# EAGLE board Mustang_Duino (EAGLE 7.7.0)
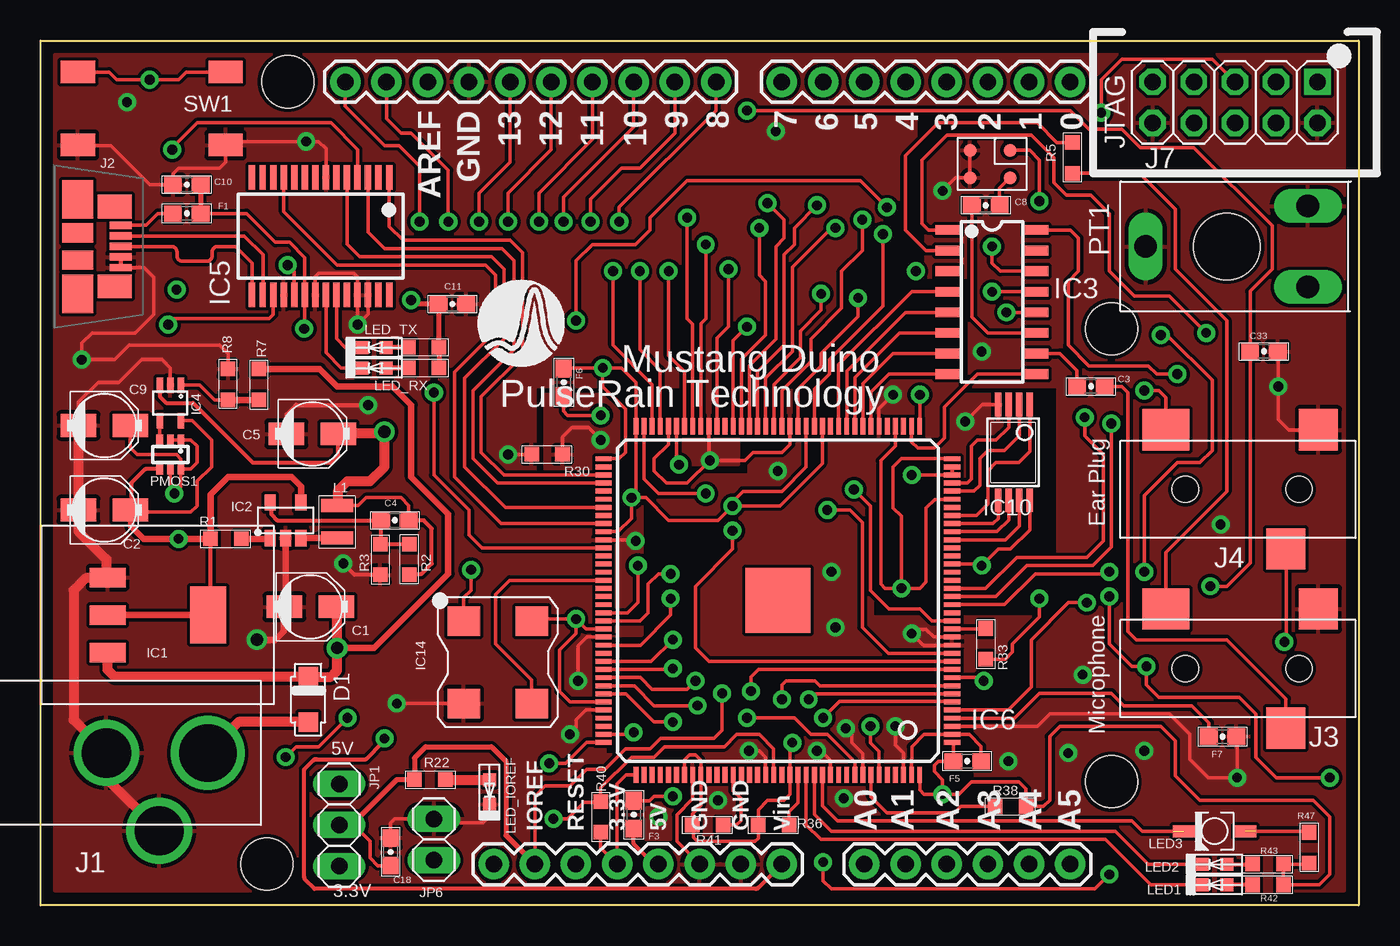
[diagram p14: board, top side]
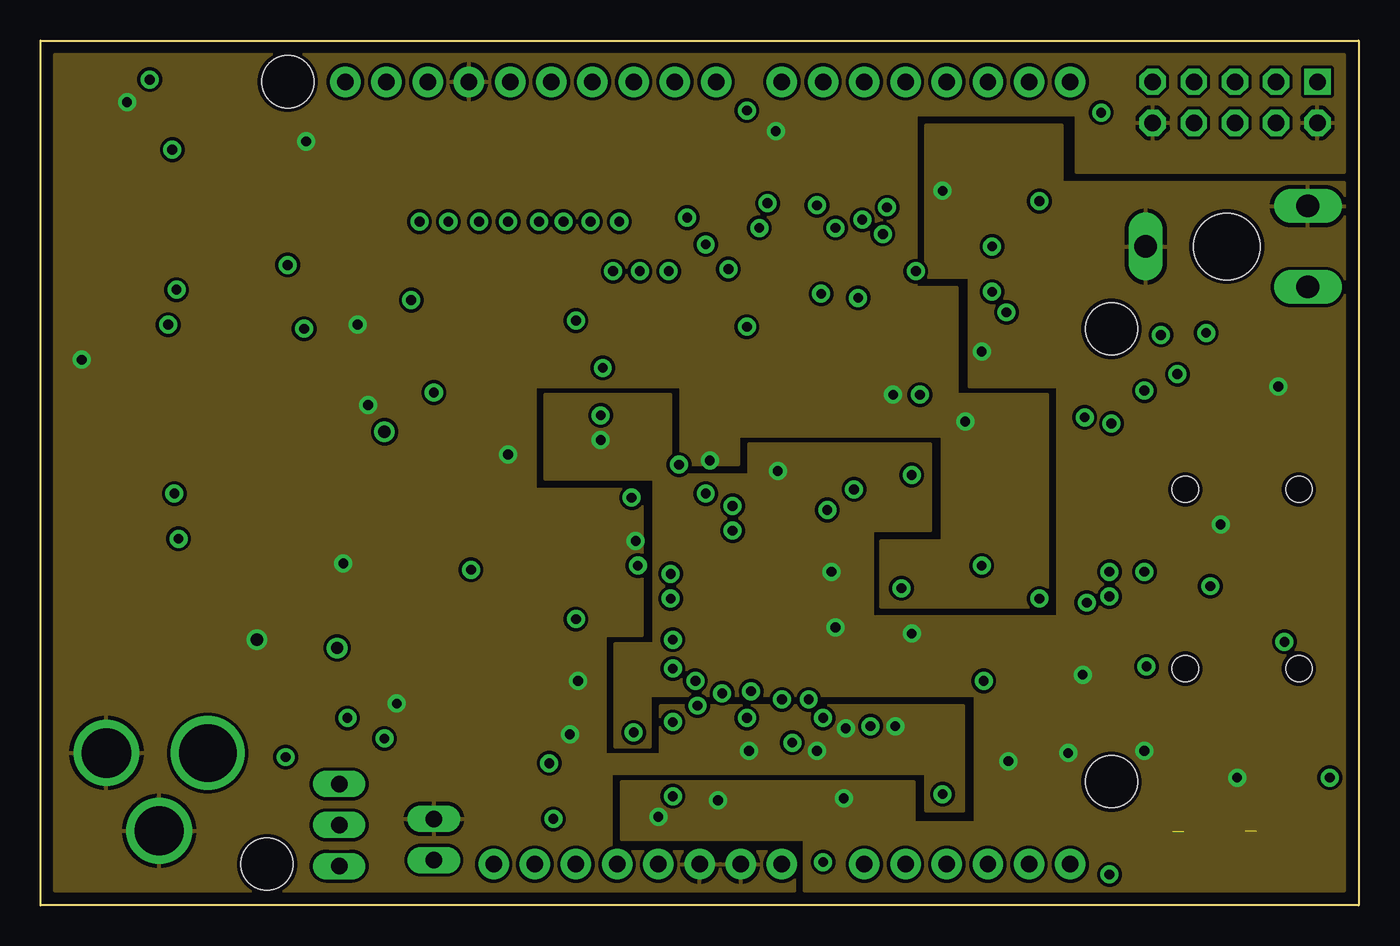
[diagram p15: board, inner layer Ground]
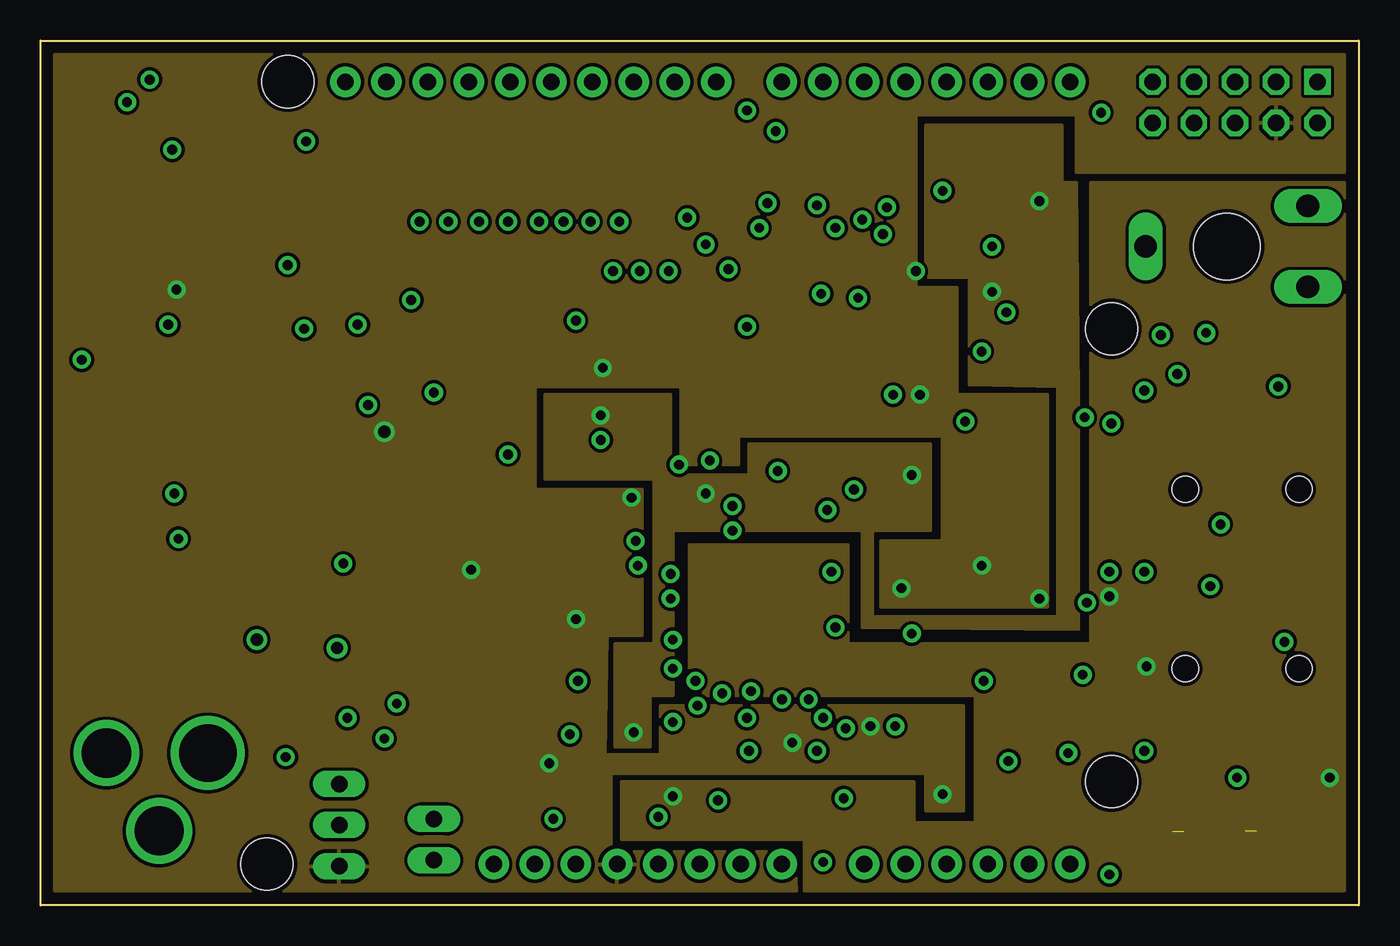
[diagram p16: board, inner layer Power]
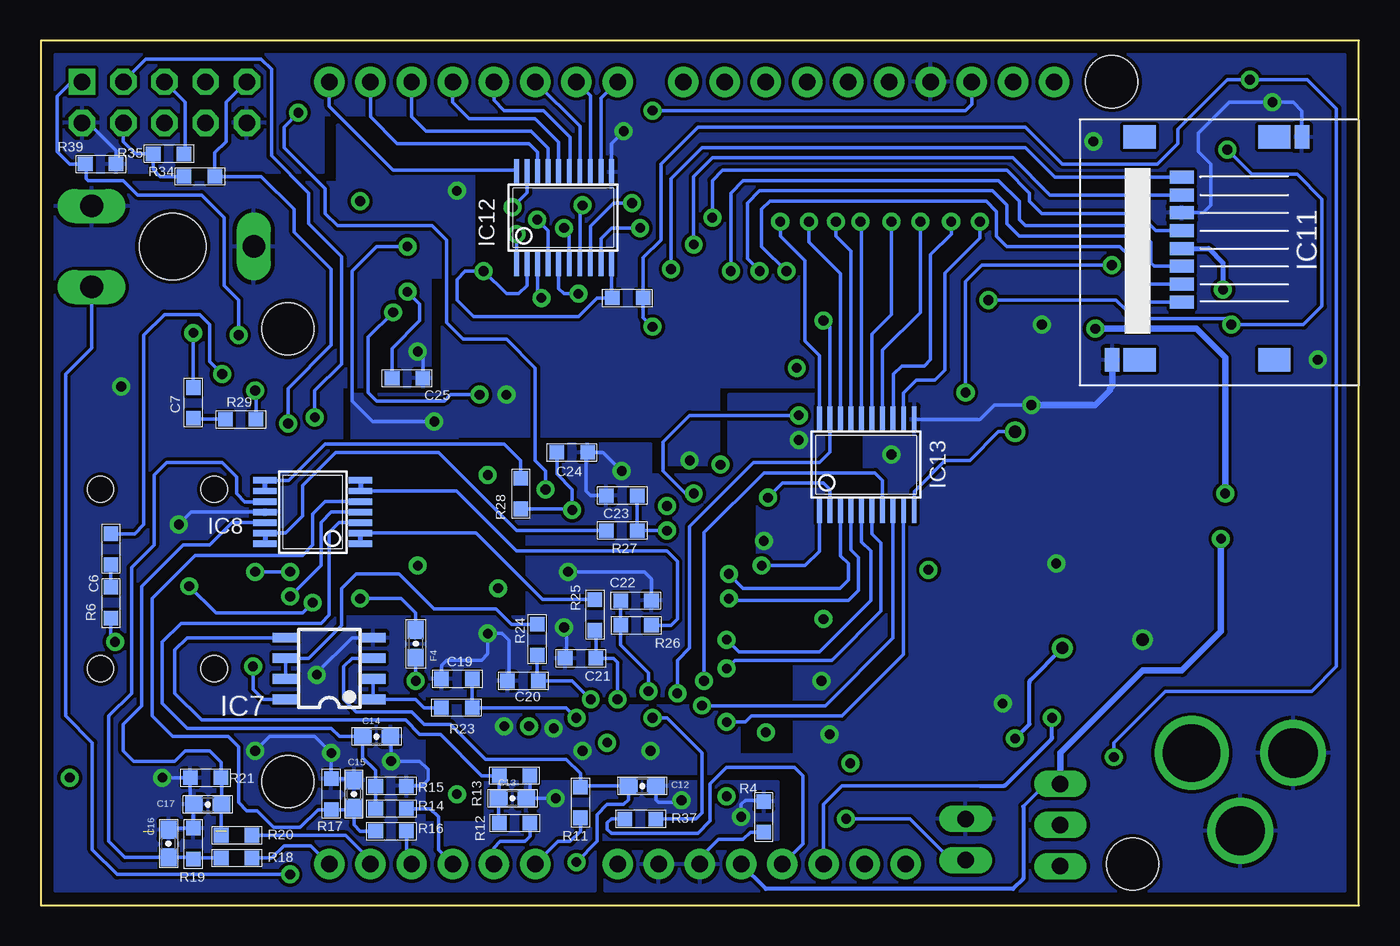
[diagram p17: board, bottom side, seen from below]

Size 81.28 x 53.34 mm. Coordinates in mm from the lower left corner, seen from the top.
Copper layers (1+2*15+16): Top 0.035mm / dielectric 0.14328125mm / Ground 0.018mm / dielectric 0.39mm / Power 0.018mm / dielectric 0.14328125mm / Bottom 0.035mm
Design rules "PulseRain_default *": minimum track width 6mil, minimum drill 20mil, track to track 8mil, track to pad 8mil, pad to pad 7.5mil, via to via 7.5mil, smd to smd 7.5mil, copper to edge 10mil, drill to drill 8mil, minimum pad ring 12mil, minimum via ring 10mil, stop-mask expansion 4mil, vias tented up to drill 25mil, thermal gap 10mil
Net classes: 0 default: width 0.203 mm, clearance 0.191 mm; 1 supply: width 0.203 mm, clearance 0.191 mm; 2 diff: width 0.203 mm, clearance 0.191 mm

## Footprints (pad centres in the part's own frame; a part is rotated, then mirrored left to right if it is on the bottom)
PANASONIC_B = smd 2.2 x 1.4: + 1.6,0; - -1.6,0
0603-CAP = smd 1.1 x 1: 1 -0.85,0; 2 0.85,0
VISHAY-R-0603 = smd 0.9 x 0.9: P$1 0.95,0; P$2 -0.95,0
SOD123W = smd 1.2 x 1.2: 1 1.4,0; 2 -1.4,0
0603-BEAD = smd 1.1 x 1: 1 -0.85,0; 2 0.85,0
SOT223 = smd 1.194 x 2.21: 1 -2.311,-3.099; 2 0,-3.099; 3 2.311,-3.099 | smd 3.505 x 2.21: VOUT 0,3.099
TSOT25 = smd 0.7 x 1: 1 -0.95,-1.1; 2 0,-1.1; 3 0.95,-1.1; 4 0.95,1.1; 5 -0.95,1.1
SOIC-16 = smd 0.6 x 1.55: 1 -4.445,-2.7; 2 -3.175,-2.7; 3 -1.905,-2.7; 4 -0.635,-2.7; 5 0.635,-2.7; 6 1.905,-2.7; 7 3.175,-2.7; 8 4.445,-2.7; 9 4.445,2.7; 10 3.175,2.7; 11 1.905,2.7; 12 0.635,2.7; 13 -0.635,2.7; 14 -1.905,2.7; 15 -3.175,2.7; 16 -4.445,2.7
SC-70-5 = smd 0.4 x 0.95: 1 -0.65,-1.1; 2 0,-1.1; 3 0.65,-1.1; 4 0.65,1.1; 5 -0.65,1.1
SSOP28 = smd 0.4 x 1.5: 1 -4.225,-3.625; 2 -3.575,-3.625; 3 -2.925,-3.625; 4 -2.275,-3.625; 5 -1.625,-3.625; 6 -0.975,-3.625; 7 -0.325,-3.625; 8 0.325,-3.625; 9 0.975,-3.625; 10 1.625,-3.625; 11 2.275,-3.625; 12 2.925,-3.625; 13 3.575,-3.625; 14 4.225,-3.625; 15 4.225,3.625; 16 3.575,3.625; 17 2.925,3.625; 18 2.275,3.625; 19 1.625,3.625; 20 0.975,3.625; 21 0.325,3.625; 22 -0.325,3.625; 23 -0.975,3.625; 24 -1.625,3.625; 25 -2.275,3.625; 26 -2.925,3.625; 27 -3.575,3.625; 28 -4.225,3.625
EQFP144 = smd 1 x 0.3: 1 -10.75,8.75; 2 -10.75,8.25; 3 -10.75,7.75; 4 -10.75,7.25; 5 -10.75,6.75; 6 -10.75,6.25; 7 -10.75,5.75; 8 -10.75,5.25; 9 -10.75,4.75; 10 -10.75,4.25; 11 -10.75,3.75; 12 -10.75,3.25; 13 -10.75,2.75; 14 -10.75,2.25; 15 -10.75,1.75; 16 -10.75,1.25; 17 -10.75,0.75; 18 -10.75,0.25; 19 -10.75,-0.25; 20 -10.75,-0.75; 21 -10.75,-1.25; 22 -10.75,-1.75; 23 -10.75,-2.25; 24 -10.75,-2.75; 25 -10.75,-3.25; 26 -10.75,-3.75; 27 -10.75,-4.25; 28 -10.75,-4.75; 29 -10.75,-5.25; 30 -10.75,-5.75; 31 -10.75,-6.25; 32 -10.75,-6.75; 33 -10.75,-7.25; 34 -10.75,-7.75; 35 -10.75,-8.25; 36 -10.75,-8.75; 73 10.75,-8.75; 74 10.75,-8.25; 75 10.75,-7.75; 76 10.75,-7.25; 77 10.75,-6.75; 78 10.75,-6.25; 79 10.75,-5.75; 80 10.75,-5.25; 81 10.75,-4.75; 82 10.75,-4.25; 83 10.75,-3.75; 84 10.75,-3.25; 85 10.75,-2.75; 86 10.75,-2.25; 87 10.75,-1.75; 88 10.75,-1.25; 89 10.75,-0.75; 90 10.75,-0.25; 91 10.75,0.25; 92 10.75,0.75; 93 10.75,1.25; 94 10.75,1.75; 95 10.75,2.25; 96 10.75,2.75; 97 10.75,3.25; 98 10.75,3.75; 99 10.75,4.25; 100 10.75,4.75; 101 10.75,5.25; 102 10.75,5.75; 103 10.75,6.25; 104 10.75,6.75; 105 10.75,7.25; 106 10.75,7.75; 107 10.75,8.25; 108 10.75,8.75 | smd 0.3 x 1: 37 -8.75,-10.75; 38 -8.25,-10.75; 39 -7.75,-10.75; 40 -7.25,-10.75; 41 -6.75,-10.75; 42 -6.25,-10.75; 43 -5.75,-10.75; 44 -5.25,-10.75; 45 -4.75,-10.75; 46 -4.25,-10.75; 47 -3.75,-10.75; 48 -3.25,-10.75; 49 -2.75,-10.75; 50 -2.25,-10.75; 51 -1.75,-10.75; 52 -1.25,-10.75; 53 -0.75,-10.75; 54 -0.25,-10.75; 55 0.25,-10.75; 56 0.75,-10.75; 57 1.25,-10.75; 58 1.75,-10.75; 59 2.25,-10.75; 60 2.75,-10.75; 61 3.25,-10.75; 62 3.75,-10.75; 63 4.25,-10.75; 64 4.75,-10.75; 65 5.25,-10.75; 66 5.75,-10.75; 67 6.25,-10.75; 68 6.75,-10.75; 69 7.25,-10.75; 70 7.75,-10.75; 71 8.25,-10.75; 72 8.75,-10.75; 109 8.75,10.75; 110 8.25,10.75; 111 7.75,10.75; 112 7.25,10.75; 113 6.75,10.75; 114 6.25,10.75; 115 5.75,10.75; 116 5.25,10.75; 117 4.75,10.75; 118 4.25,10.75; 119 3.75,10.75; 120 3.25,10.75; 121 2.75,10.75; 122 2.25,10.75; 123 1.75,10.75; 124 1.25,10.75; 125 0.75,10.75; 126 0.25,10.75; 127 -0.25,10.75; 128 -0.75,10.75; 129 -1.25,10.75; 130 -1.75,10.75; 131 -2.25,10.75; 132 -2.75,10.75; 133 -3.25,10.75; 134 -3.75,10.75; 135 -4.25,10.75; 136 -4.75,10.75; 137 -5.25,10.75; 138 -5.75,10.75; 139 -6.25,10.75; 140 -6.75,10.75; 141 -7.25,10.75; 142 -7.75,10.75; 143 -8.25,10.75; 144 -8.75,10.75 | smd 4 x 4: E 0,0
SOIC-SN-8 = smd 0.6 x 1.55: 1 -1.905,-2.7; 2 -0.635,-2.7; 3 0.635,-2.7; 4 1.905,-2.7; 5 1.905,2.7; 6 0.635,2.7; 7 -0.635,2.7; 8 -1.905,2.7
TSSOP-ST-14 = smd 0.4 x 1.45: 1 -1.95,-2.95; 2 -1.3,-2.95; 3 -0.65,-2.95; 4 0,-2.95; 5 0.65,-2.95; 6 1.3,-2.95; 7 1.95,-2.95; 8 1.95,2.95; 9 1.3,2.95; 10 0.65,2.95; 11 0,2.95; 12 -0.65,2.95; 13 -1.3,2.95; 14 -1.95,2.95
TSSOP-ST-8 = smd 0.4 x 1.45: 1 -1.95,-2.95; 2 -1.3,-2.95; 3 -0.65,-2.95; 4 0,-2.95; 5 0,2.95; 6 -0.65,2.95; 7 -1.3,2.95; 8 -1.95,2.95
ALPS-SCHD3A0100 = smd 0.8 x 1.5: 1 3.3,0; 2 2.2,0; 3 1.1,0; 4 0,0; 5 -1.1,0; 6 -2.2,0; 7 -3.3,0; 8 -4.4,0 | smd 1.45 x 2: EP1 -6.875,5.7; EP2 -6.875,-2.6; EP3 6.875,-2.6; EP4 6.875,5.7 | smd 1.45 x 0.9: GND1 -6.875,7.4; GND2 6.875,-4.3
TSSOP8 = smd 0.3 x 1.6: 1 -2.925,-2.8; 2 -2.275,-2.8; 3 -1.625,-2.8; 4 -0.975,-2.8; 5 -0.325,-2.8; 6 0.325,-2.8; 7 0.975,-2.8; 8 1.625,-2.8; 9 2.275,-2.8; 10 2.925,-2.8; 11 2.925,2.8; 12 2.275,2.8; 13 1.625,2.8; 14 0.975,2.8; 15 0.325,2.8; 16 -0.325,2.8; 17 -0.975,2.8; 18 -1.625,2.8; 19 -2.275,2.8; 20 -2.925,2.8
KC7050K = smd 1.8 x 2: 1 -2.54,-2.1; 2 2.54,-2.1; 3 2.54,2.1; 4 -2.54,2.1
RAPC722X = drill 3.048 pad 4.064: 1 4.801,3.251; 2 0,0 | drill 3.556 pad 4.572: 3 0,6.248
SD-47346-001 = smd 1.38 x 0.45: 1 2.66,1.3; 2 2.66,0.65; 3 2.66,0; 4 2.66,-0.65; 5 2.66,-1.3 | smd 1.9 x 2.375: EP1 0,2.913; EP4 0,-2.913 | smd 1.9 x 1.175: EP2 0,0.838; EP3 0,-0.838 | smd 2.1 x 1.475: EP5 2.3,-2.462; EP6 2.3,2.462
PHONE_JACK_NOT_SWITCHED = smd 2.4 x 2.55: 1 0.8,3.675; 5 -1.2,-3.675 | smd 2.9 x 2.55: 4 8.2,-3.675 | hole 1.6: 0,0; 7,0
2X05 = drill 1.016 square: 1 -5.08,-1.27 | drill 1.016 octagon: 2 -5.08,1.27; 3 -2.54,-1.27; 4 -2.54,1.27; 5 0,-1.27; 6 0,1.27; 7 2.54,-1.27; 8 2.54,1.27; 9 5.08,-1.27; 10 5.08,1.27
DUINO_IO_HEADER_10 = drill 1.016 pad 1.88: 8 22.606,0; 9 20.066,0; 10 17.526,0; 11 14.986,0; 12 12.446,0; 13 9.906,0; AREF 4.826,0; GND 7.366,0; SCL -0.254,0; SDA 2.286,0
DUINO_IO_HEADER_8 = drill 1.016 pad 1.88: 0 17.78,0; 1 15.24,0; 2 12.7,0; 3 10.16,0; 4 7.62,0; 5 5.08,0; 6 2.54,0; 7 0,0
DUINO_PWR_HEADER_8 = drill 1.016 pad 1.88: 3.3V 7.62,0; 5V 10.16,0; GND. 15.24,0; GND.. 12.7,0; I/OREF 2.54,0; N/C 0,0; RESET 5.08,0; VIN 17.78,0
DUINO_ANALOG_HEADER_6 = drill 1.016 pad 1.88: A0 0,0; A1 2.54,0; A2 5.08,0; A3 7.62,0; A4 10.16,0; A5 12.7,0
1X03 = drill 1.016 long: 1 -2.54,0; 2 0,0; 3 2.54,0
1X02 = drill 1.016 long: 1 -1.27,0; 2 1.27,0
DFE252012C = smd 0.8 x 2: 1 1,0; 2 -1,0
HARVATEK_0603 = smd 0.8 x 0.8: A -0.75,0; C 0.75,0
VISHAY_VLD_1235G = smd 1.35 x 0.75: A 1.9,0; C -1.9,0
MEMS_MICROPHONE = smd 0.8 x 0.8: 1 -0.85,1.23; 2 -0.85,-1.23; 3 0.85,-1.23; 4 0.85,1.23
SC70-6L = smd 0.41 x 0.65: 1 -0.65,-0.9; 2 0,-0.9; 3 0.65,-0.9; 4 0.65,0.9; 5 -0.65,0.9; 6 0,0.9
PT10LV10 = drill 1.4 long: 1A -2.5,-5; 1E 2.5,-5; 1S 0,5 | hole 4.1: 0,0
TE-2-1437565-8 = smd 1.4 x 2.1: 1 2.25,4.55; 2 2.25,-4.55; 3 -2.25,4.55; 4 -2.25,-4.55
DUINO = hole 3.2: 66.04,7.62; 66.04,35.56; 15.24,50.8; 13.97,2.54

## Placement (x,y rotation side)
C1  22u  [PANASONIC_B]  16.64,18.41 0 top
C2  22u  [PANASONIC_B]  3.94,24.38 0 top
C3  0.1u  [0603-CAP]  64.77,32 0 top
C4  22p  [0603-CAP]  21.84,23.75 180 top
C5  22u  [PANASONIC_B]  16.76,29.08 0 top
C6  1u  [VISHAY-R-0603]  76.96,21.97 90 bottom
C7  1u  [VISHAY-R-0603]  71.88,30.99 90 bottom
C8  0.1u  [0603-CAP]  58.29,43.18 0 top
C9  22u  [PANASONIC_B]  3.94,29.59 0 top
C10  0.1u  [0603-CAP]  9.02,44.45 180 top
C11  0.1u  [0603-CAP]  25.4,37.08 0 top
C12  1p  [0603-CAP]  44.2,7.37 0 bottom
C13  1p  [0603-CAP]  52.2,6.6 0 bottom
C14  1p  [0603-CAP]  60.58,10.41 0 bottom
C15  1p  [0603-CAP]  61.98,6.86 90 bottom
C16  1p  [0603-CAP]  73.41,3.81 90 bottom
C17  1p  [0603-CAP]  70.99,6.22 180 bottom
C18  0.1u  [0603-CAP]  21.59,3.3 90 top
C19  1000p  [VISHAY-R-0603]  55.63,13.97 0 bottom
C20  1000p  [VISHAY-R-0603]  51.56,13.84 0 bottom
C21  1000p  [VISHAY-R-0603]  48.01,15.24 0 bottom
C22  1000p  [VISHAY-R-0603]  44.58,18.8 180 bottom
C23  1000p  [VISHAY-R-0603]  45.47,25.27 0 bottom
C24  1000p  [VISHAY-R-0603]  48.51,27.94 180 bottom
C25  1u  [VISHAY-R-0603]  58.67,32.51 180 bottom
C33  0.1u  [0603-CAP]  75.44,34.16 0 top
D1  PMEG3020ER  [SOD123W]  16.51,12.7 90 top
F1  BLM18PG121SZ1D  [0603-BEAD]  9.02,42.67 0 top
F3  BLM18PG121SZ1D  [0603-BEAD]  36.58,5.59 270 top
F4  BLM18PG121SZ1D  [0603-BEAD]  58.17,16.13 270 bottom
F5  BLM18PG121SZ1D  [0603-BEAD]  57.15,8.89 0 top
F6  BLM18PG121SZ1D  [0603-BEAD]  32.26,32.26 270 top
F7  BLM18PG121SZ1D  [0603-BEAD]  72.9,10.41 180 top
IC1  AZ1117IH-5.0TRG1  [SOT223]  7.24,17.91 270 top
IC2  AP3429A  [TSOT25]  15.11,23.75 0 top
IC3  SI3000  [SOIC-16]  58.67,37.21 270 top
IC4  MCP6241UT-E/LT  [SC-70-5]  8,30.99 180 top
IC5  FT232RL  [SSOP28]  17.27,41.27 180 top
IC6  MAX10M08SAE144  [EQFP144]  45.47,18.8 180 top
IC7  MCP6242T-E/SN  [SOIC-SN-8]  63.5,14.61 90 bottom
IC8  MCP6244T-E/ST  [TSSOP-ST-14]  64.52,24.26 90 bottom
IC10  SRAM  [TSSOP-ST-8]  59.05,27.94 180 top
IC11  MICRO_SD_SOCKET  [ALPS-SCHD3A0100]  10.92,40.51 270 bottom
IC12  TXS0108EPWR  [TSSOP8]  49.02,42.42 0 bottom
IC13  TXS0108EPWR  [TSSOP8]  30.35,27.18 0 bottom
IC14  12MHz  [KC7050K]  28.19,14.99 270 top
J1  RAPC722X  [RAPC722X]  4.06,9.4 270 top
J2  MICRO-USB-B  [SD-47346-001]  2.29,40.64 0 top
J3  PHONE_JACK_NOT_SWITCHED  [PHONE_JACK_NOT_SWITCHED]  77.6,14.61 180 top
J4  PHONE_JACK_NOT_SWITCHED  [PHONE_JACK_NOT_SWITCHED]  77.6,25.65 180 top
J7  ALTERA_JTAG  [2X05]  73.66,49.53 180 top
J8  DUINO_IO_HEADER_10  [DUINO_IO_HEADER_10]  19.05,50.8 0 top
J9  DUINO_HEADER_8  [DUINO_IO_HEADER_8]  45.72,50.8 0 top
J10  DUINO_HEADER_8  [DUINO_PWR_HEADER_8]  27.94,2.54 0 top
J11  DUINO_ANALOG_HEADER_6  [DUINO_ANALOG_HEADER_6]  50.8,2.54 0 top
JP1  IOREF JUMPER  [1X03]  18.41,4.95 270 top
JP6  BOOT IMAGE SELECT  [1X02]  24.26,4.06 90 top
L1  2.2u  [DFE252012C]  18.29,23.67 270 top
LED1  GREEN  [HARVATEK_0603]  72.39,1.27 180 top
LED2  RED  [HARVATEK_0603]  72.39,2.54 180 top
LED3  VLDR1235G  [VISHAY_VLD_1235G]  72.39,4.57 0 top
LED_IOREF  BLUE  [HARVATEK_0603]  27.69,6.99 270 top
LED_RX  GREEN  [HARVATEK_0603]  20.57,33.15 180 top
LED_TX  RED  [HARVATEK_0603]  20.57,34.42 180 top
MIC1  MEMS_MICROPHONE  [MEMS_MICROPHONE]  58.55,45.72 270 top
PMOS1  PMOS_SQ1421EDH  [SC70-6L]  8,27.81 180 top
PT1  200k  [PT10LV10]  73.15,40.64 90 top
R1  10k  [VISHAY-R-0603]  11.43,22.61 180 top
R2  226k, 1%  [VISHAY-R-0603]  22.73,21.34 90 top
R3  49.9k, 1%  [VISHAY-R-0603]  20.95,21.34 270 top
R4  0  [VISHAY-R-0603]  36.7,5.46 270 bottom
R5  2.2k  [VISHAY-R-0603]  63.63,46.1 90 top
R6  30  [VISHAY-R-0603]  76.96,18.67 270 bottom
R7  10k  [VISHAY-R-0603]  13.46,32.13 270 top
R8  10k  [VISHAY-R-0603]  11.56,32.13 90 top
R9  330  [VISHAY-R-0603]  23.62,34.42 180 top
R10  330  [VISHAY-R-0603]  23.62,33.15 180 top
R11  100k  [VISHAY-R-0603]  48.01,6.35 270 bottom
R12  100k  [VISHAY-R-0603]  52.07,5.08 0 bottom
R13  200k  [VISHAY-R-0603]  52.07,8 180 bottom
R14  100k  [VISHAY-R-0603]  59.69,5.97 0 bottom
R15  200k  [VISHAY-R-0603]  59.69,7.37 0 bottom
R16  100k  [VISHAY-R-0603]  59.69,4.57 0 bottom
R17  200k  [VISHAY-R-0603]  63.37,6.86 90 bottom
R18  100k  [VISHAY-R-0603]  69.22,2.92 0 bottom
R19  200k  [VISHAY-R-0603]  71.88,3.81 270 bottom
R20  100k  [VISHAY-R-0603]  69.22,4.32 0 bottom
R21  200k  [VISHAY-R-0603]  71.12,7.87 180 bottom
R22  330  [VISHAY-R-0603]  24,7.75 0 top
R23  100  [VISHAY-R-0603]  55.63,12.19 180 bottom
R24  100  [VISHAY-R-0603]  50.67,16.38 90 bottom
R25  100  [VISHAY-R-0603]  47.12,17.91 90 bottom
R26  100  [VISHAY-R-0603]  44.58,17.27 0 bottom
R27  100  [VISHAY-R-0603]  45.47,23.11 0 bottom
R28  100  [VISHAY-R-0603]  51.69,25.4 270 bottom
R29  30  [VISHAY-R-0603]  68.96,29.97 0 bottom
R30  0  [VISHAY-R-0603]  31.24,27.81 180 top
R32  DNI  [VISHAY-R-0603]  45.09,37.47 180 bottom
R33  10k  [VISHAY-R-0603]  58.29,16.13 270 top
R34  10k  [VISHAY-R-0603]  71.5,44.96 0 bottom
R35  10k  [VISHAY-R-0603]  73.41,46.35 0 bottom
R36  10k  [VISHAY-R-0603]  45.21,4.95 180 top
R37  10k  [VISHAY-R-0603]  44.32,5.33 0 bottom
R38  10k  [VISHAY-R-0603]  59.82,6.1 180 top
R39  1k  [VISHAY-R-0603]  77.6,45.72 0 bottom
R40  10k  [VISHAY-R-0603]  34.54,5.46 270 top
R41  10k  [VISHAY-R-0603]  41.15,4.95 180 top
R42  330  [VISHAY-R-0603]  75.69,1.27 180 top
R43  330  [VISHAY-R-0603]  75.69,2.54 180 top
R47  330  [VISHAY-R-0603]  78.23,3.56 90 top
SW1  TE-2-1437565-8  [TE-2-1437565-8]  6.86,49.15 90 top
U$2  PULSERAIN_LOGO_BIGGER  [PULSERAIN_LOGO_BIGGER]  26.92,33.15 0 top
U$8  DUINO  [DUINO]  0,0 0 top

## Tracks (layer width: path | path; a pad name or v marks a point on that pad's centre or on a via)
3V3_FLT  (via drill 0.6)
  Top 0.203: IC6.107 36.45,10.55 v36.58,10.67 | v41.02,25.4 38.1,25.4 37.22,26.28 IC6.71 | IC3.13 v58.67,37.85 | IC6.35 | IC6.34 v53.72,26.55 v53.72,26.54 | MIC1.1 61,46.57 61.59,45.97 v61.59,43.43 | F6.2 32.26,30.48 32.51,30.23 v34.54,30.23
  Top 0.254: IC6.35 IC6.34
  Bottom 0.203: v41.02,25.4 41.53,25.4 42.93,26.8 42.93,28.57 41.27,30.23 v34.54,30.23 | v58.67,37.85 57.91,37.08 57.91,36.07 59.62,34.36 C25.P$1
  pour Power: 31.11,31.5 38.86,31.5 38.86,26.54 43.69,26.54 43.69,28.45 54.86,28.45 54.86,23.11 51.31,23.11 51.31,17.78 62.74,17.78 62.74,32 57.28,32.13 57.28,38.73 54.61,38.73 54.61,48.13 62.99,48.13 62.99,44.58 63.88,44.58 64.01,31.37 64.01,17.02 50.67,17.14 50.67,23.11 38.99,23.11 38.99,12.95 37.59,12.95 37.59,9.78 35.43,9.78 35.43,16.13 37.85,16.13 37.85,26.29 31.11,26.29
3V3_PIN0_RX  (via drill 0.6)
  Top 0.203: v51.94,41.4 51.95,41.65 IC12.1 51.94,36.96 48.64,33.66 48.64,32.77 47.72,31.84 IC6.50
  Bottom 0.203: IC12.1 51.95,41.65 v51.94,41.4
3V3_PIN1_TX  (via drill 0.6)
  Top 0.203: IC6.52 46.72,31.86 48.13,33.27 48.13,34.04 50.42,36.32 v50.42,37.47
  Bottom 0.203: IC12.3 50.65,37.69 v50.42,37.47
3V3_PIN2  (via drill 0.6)
  Top 0.203: IC6.54 45.72,29.59 45.72,31.75 47.5,33.53 47.5,34.92 49.4,36.83 49.4,39.12 50.67,40.39 v50.67,42.29
  Bottom 0.203: IC12.4 50,41.62 v50.67,42.29
3V3_PIN3~  (via drill 0.6)
  Top 0.203: IC6.55 45.22,32.13 46.86,33.78 46.86,35.43 48.13,36.7 v48.13,37.72
  Bottom 0.203: IC12.5 49.35,38.04 49.02,37.72 v48.13,37.72
3V3_PIN4  (via drill 0.6)
  Top 0.203: IC6.56 44.72,32.52 46.35,34.16 46.35,39.37 48.77,41.78 v49.02,41.78
  Bottom 0.203: IC12.6 48.7,41.46 v49.02,41.78
3V3_PIN5~  (via drill 0.6)
  Top 0.203: IC6.57 44.22,32.91 45.85,34.54 45.85,40.13 46.48,40.77 46.48,41.78 v47.88,43.18
  Bottom 0.203: IC12.7 48.05,43.01 v47.88,43.18
3V3_PIN6~  (via drill 0.6)
  Top 0.203: IC6.58 43.72,33.3 45.34,34.92 45.34,40.64 45.85,41.15 45.85,42.29 v44.83,43.31
  Bottom 0.203: IC12.8 47.4,41.88 45.97,43.31 v44.83,43.31
3V3_PIN7  (via drill 0.6)
  Top 0.203: IC6.59 43.22,33.69 44.7,35.18 44.7,38.48 44.32,38.86 v44.32,41.78
  Bottom 0.203: IC12.9 46.75,41.14 46.1,41.78 v44.32,41.78
3V3_PIN8  (via drill 0.6)
  Top 0.203: IC6.92 36.21,18.05 36.83,18.67 v36.83,20.95
  Bottom 0.203: IC13.1 33.28,21.84 34.16,20.95 v36.83,20.95
3V3_PIN9~  (via drill 0.6)
  Top 0.203: v38.86,20.45 38.1,20.45 37.47,19.81 37.47,18.03 36.98,17.55 IC6.93
  Bottom 0.203: IC13.3 31.98,21.56 31.5,21.08 31.5,20.07 32,19.56 37.97,19.56 v38.86,20.45
3V3_PIN10~  (via drill 0.6)
  Top 0.203: v38.86,18.92 38.86,17.91 37,16.05 IC6.96
  Bottom 0.203: IC13.4 31.33,21.93 30.86,21.46 30.86,19.43 31.5,18.8 38.73,18.8 v38.86,18.92
3V3_PIN11~  (via drill 0.6)
  Top 0.203: IC6.98 37.65,15.05 v38.99,16.38
  Bottom 0.203: 38.86,16.26 v38.99,16.38 38.23,15.62 33.27,15.62 30.1,18.8 30.1,21.84 30.68,22.42 IC13.5
3V3_PIN12  (via drill 0.6)
  Top 0.203: IC6.99 38.93,14.55 v38.99,14.61
  Bottom 0.203: IC13.6 30.03,22.92 29.46,22.35 29.46,18.16 32.51,15.11 38.48,15.11 v38.99,14.61
3V3_PIN13  (via drill 0.6)
  Top 0.203: v40.39,13.84 39.88,13.34 37.72,13.34 37.01,14.05 IC6.100
  Bottom 0.203: v40.39,13.84 40.39,22.99 36.7,26.67 29.84,26.67 29.38,26.2 IC13.7
3V3_SCL  (via drill 0.6)
  Top 0.203: IC6.102 36.1,13.05 37.85,11.3 v38.99,11.3
  Bottom 0.203: IC13.9 28.08,15.48 31.88,11.68 37.47,11.68 37.85,11.3 v38.99,11.3
3V3_SDA  (via drill 0.6)
  Top 0.203: IC6.101 36.62,13.55 37.85,12.32 v40.51,12.32
  Bottom 0.203: v40.51,12.32 32.89,12.32 28.73,16.48 IC13.8
5V_FLT  (via drill 0.6)
  Top 0.203: v79.5,7.87 76.2,7.87 74.93,9.14 74.93,11.81 73.91,12.83 68.96,12.83 68.2,13.59 v68.2,14.73 67.31,14.73 65.91,16.13 v65.91,19.05 | F3.1 37.55,6.44 37.85,6.73 v38.99,6.73
  Bottom 0.203: v68.2,14.73 68.2,13.34 67.56,12.7 IC7.8 | v65.91,19.05 64.01,20.95 64.01,23.62 63.37,24.26 IC8.4
  pour Power: 35.81,7.62 53.85,7.62 53.85,5.08 57.66,5.08 57.66,12.95 40.01,12.95 40.01,22.23 49.78,22.23 49.78,16.13 64.77,16.13 64.77,44.58 80.39,44.58 80.39,0.89 47.12,0.89 47.12,4.06 35.81,4.06
+3V3  (via drill 0.6, 0.76)
  Top 0.203: v36.45,25.15 36.72,25.41 IC6.72 36.72,32.24 35.81,33.15 v34.67,33.15 | IC6.82 35.62,23.05 36.45,23.88 v36.45,25.15 | v46.35,10.03 46.22,9.89 IC6.128 46.22,6.85 45.85,6.48 44.83,6.48 44.26,5.91 R36.P$1 44.26,4.13 44.07,3.94 40.51,3.94 40.26,4.19 40.26,4.89 R41.P$1 | 40.26,5.14 R41.P$1 | R41.P$1 40.2,5.65 40.72,6.17 IC6.117 40.72,8.94 40.39,9.27 40.01,9.27 39.72,8.98 IC6.115 | C4.1 22.69,24.68 22.23,25.15 20.07,25.15 19.59,24.67 L1.2 | IC6.67 39.22,27.33 v39.37,27.18 | v31.37,8.76 32.38,8.76 33.67,10.05 IC6.108 | IC6.94 33.63,17.05 v33.02,17.65 | IC6.49 48.22,27.26 45.59,24.64 v42.67,24.64 | IC6.51 47.22,27.02 45.72,25.53 43.31,25.53 42.67,24.89 v42.67,24.64 | IC6.31 55.15,25.05 54.61,24.51 54.61,19.94 54.23,19.56 v53.09,19.56 | IC6.37 54.22,31.48 v54.23,31.5 | IC3.12 v59.56,36.58 | R47.P$2 78.17,2.54 R43.P$2 R42.P$2 78.87,1.27 79.5,1.91 79.5,5.46 78.49,6.48 71.5,6.48 69.98,8 69.98,10.16 69.09,11.05 62.87,11.05 62.23,10.41 62.23,6.48 61.85,6.1 R38.P$2 60.77,7.18 60.33,7.62 57.4,7.62 56.64,6.86 v55.63,6.86 | IC14.4 30.42,17.65 v33.02,17.65 | IC14.1 26.09,18.98 26.54,19.43 v26.54,20.7 | v61.59,18.92 61.59,17.78 59.94,16.13 59.94,15.62 59.5,15.18 R33.P$1 | IC6.36 53.07,27.55 52.58,27.05 52.58,24.51 53.09,24 v53.09,19.56 | IC6.40 52.72,28.33 51.82,27.43 51.82,19.81 52.07,19.56 v53.09,19.56 | IC6.23 57.95,21.05 v58.04,20.95 59.05,21.97 59.82,21.97 61.01,23.16 IC10.8 | IC6.139 51.72,9.5 51.18,10.03 v51.18,11.05 | 54.23,8.03 IC6.144 54.22,7.12 54.48,6.86 v55.63,6.86 | IC6.1 56.23,10.03 56.26,10.03 56.3,9.99 F5.1 55.37,8.89 55.12,8.64 55.12,8.26 55.63,7.75 v55.63,6.86
  Top 0.203: R40.P$1 34.54,3.56 J10.3.3V 35.56,7.49 36.11,8.05 IC6.109 | F6.1 32.3,33.15 v34.67,33.15 | IC6.73 35.67,27.55 36.07,27.94 36.07,30.61 34.67,32 v34.67,33.15 | IC6.103 32.67,12.55 32,13.21 32,15.75 33.02,16.76 v33.02,17.65 | v42.67,24.64 41.78,23.75 38.73,23.75 37.34,25.15 v36.45,25.15
  Top 0.254: R2.P$2 22.73,20.45 23.5,20.45 24.13,21.08 24.13,23.24 23.62,23.75 C4.1 | C5.+ 18.36,27.76 17.91,27.3 13.08,27.3 9.4,30.99 7.75,30.99 7.35,31.38 IC4.3
  Top 0.61: L1.2 18.36,24.75 18.36,25.6 18.92,26.16 20.32,26.16 21.21,27.05 v21.21,29.21 21.13,29.13 18.36,29.13 | C5.+ 18.36,29.13 | 18.36,29.13 18.29,29.21
  Bottom 0.203: IC12.10 46.1,37.53 R32.P$1 46.99,37.47 48.13,36.32 54.61,36.32 55.63,37.34 55.63,38.61 55.12,39.12 v53.98,39.12 52.58,37.72 51.82,37.72 51.3,38.24 IC12.2 | IC13.10 27.43,25.53 25.53,27.43 24,27.43 22.23,29.21 v21.21,29.21 | IC13.2 32.63,25.64 33.02,26.04 35.56,26.04 v36.45,25.15 | J7.4 76.2,47.12 75.44,46.35 R35.P$2 74.36,45.4 73.91,44.96 R34.P$2 | 58.2,16.51 F4.1 58.17,18.03 59.05,18.92 v61.59,18.92 | R37.P$2 46.1,5.33 46.35,5.08 46.35,4.7 46.1,4.45 40.77,4.45 40.01,5.21 40.01,7.49 38.99,8.51 34.8,8.51 34.29,8 34.29,3.81 J10.3.3V | v59.56,36.58 61.09,35.05 61.09,31.62 60.58,31.11 56.39,31.11 56.01,31.5 v54.23,31.5
  Bottom 0.305: IC11.4 9.27,40.51 8.38,39.62 v8.38,37.97
  pour Power: 0.89,52.45 80.39,52.45 80.39,45.21 63.88,45.21 63.88,48.77 53.98,48.77 53.98,38.1 56.52,38.1 56.52,31.5 62.1,31.5 62.1,18.41 51.82,18.41 51.82,22.48 55.63,22.48 55.63,28.96 43.05,28.96 43.05,27.18 39.5,27.18 39.5,32 30.48,32 30.48,25.65 37.08,25.65 37.08,16.64 34.92,16.64 34.8,9.27 38.23,9.27 38.23,12.32 56.9,12.32 56.9,5.84 54.61,5.84 54.61,8.13 35.18,8.13 35.18,3.3 46.48,3.3 46.61,0.89 0.89,0.89
+5V  (via drill 0.6)
  Top 0.203: IC4.5 9.36,29.89 10.54,28.7 10.54,27.05 9.65,26.16 9.65,24.64 9.27,24.26 5.66,24.26 C2.+
  Top 0.254: 5.88,24.29 C2.+ 5.59,24.43 5.59,26.04 6.47,26.91 PMOS1.4 | IC1.VOUT 10.48,18.05 R1.P$1 | J10.5V 37.85,2.54 36.58,3.81 F3.2
  Top 0.406: IC2.4 16.06,25.85 15.49,26.42 11.56,26.42 10.48,25.34 R1.P$1 v8.51,22.61 6.35,22.61 5.59,23.37 5.59,24.43 | IC1.2 IC1.VOUT
  Bottom 0.203: 20.7,6.1 19.3,7.49 JP1.1
  Bottom 0.254: 20.7,6.1 20.7,1.65 21.34,1.02 36.58,1.02 J10.5V
  Bottom 0.406: v8.51,22.61 8.51,16.89 10.92,14.48 13.34,14.48 18.41,9.4 JP1.1
A0
  Bottom 0.203: R11.P$1 48.01,4.57 48.64,3.94 49.4,3.94 J11.A0
A1
  Bottom 0.203: R12.P$1 51.12,4.25 51.44,3.94 52.96,3.94 53.34,3.56 J11.A1
A2
  Bottom 0.203: R14.P$1 57.28,5.97 56.77,5.46 56.77,3.43 J11.A2
A3
  Bottom 0.203: J11.A3 58.74,2.86 R16.P$1
A4
  Bottom 0.203: J11.A4 60.96,2.79 62.48,4.32 R20.P$1
A5
  Bottom 0.203: R18.P$1 67.06,2.92 66.29,3.68 64.64,3.68 J11.A5
ADC_IN0
  Bottom 0.203: R23.P$1 57.66,12.19 58.17,12.7 IC7.1 IC7.2
ADC_IN1
  Bottom 0.203: R24.P$1 52.26,17.33 53.21,18.29 57.02,18.29 59.18,20.45 61.85,20.45 62.74,19.56 62.74,17.27 64.77,15.24 IC7.6 IC7.7
ADC_IN2
  Bottom 0.203: R25.P$1 50.35,18.86 54.45,22.96 IC8.2
  Bottom 0.305: IC8.1 IC8.2
ADC_IN3
  Bottom 0.203: R26.P$1 42.42,17.27 42.04,17.65 42.04,21.21 42.67,21.84 51.94,21.84 55.66,25.56 IC8.6
  Bottom 0.305: IC8.7 IC8.6
ADC_IN4
  Bottom 0.203: 46.35,23.11 R27.P$2 51.94,23.11 56.52,27.69 56.77,27.94 63.12,27.94 65.15,25.91 65.15,24 66.2,22.96 IC8.13
  Bottom 0.305: IC8.13 IC8.14
ADC_IN5
  Bottom 0.203: R28.P$2 51.69,27.43 52.7,28.45 63.75,28.45 66,26.21 IC8.8
  Bottom 0.305: IC8.9 IC8.8
AGND  (via drill 0.6)
  Top 0.203: IC6.14 55.08,16.55 54.61,17.02 53.98,17.02 v53.72,16.76 54.44,16.05 IC6.13 | v55.63,44.07 56.43,44.87 MIC1.3 MIC1.2 | IC6.3 61.47,11.05 62.23,11.81 69.6,11.81 70.87,10.54 70.87,9.02 72.01,7.87 v73.79,7.87 73.79,10.38 F7.1 | C33.2 76.33,34.12 v76.33,32 76.33,29.97 76.97,29.33 J4.5 | v34.54,28.7 33.78,29.46 32.77,29.46 32.19,28.89 R30.P$2
  Bottom 0.203: C16.2 73.41,4.7 73.34,4.76 R19.P$2 71.88,6.18 C17.2 72.07,6.45 R21.P$1 v73.79,7.87 | v49.02,17.14 48.86,16.98 48.86,15.34 C21.P$2 | v48.77,20.57 44.07,20.57 43.63,20.13 C22.P$2 | v45.47,26.8 46.61,27.94 C24.P$2 47.66,27.84 47.66,25.57 47.37,25.27 C23.P$2 | v49.53,6.6 C13.2 51.12,6.83 R13.P$2 | v68.07,9.53 67.18,10.41 64.39,10.41 v63.37,9.4 R17.P$1 62.08,7.81 C15.2 | v72.77,23.5 72.01,24.26 IC8.11 | C14.2 59.69,10.38 v59.69,8.89 57.91,8.89 57.4,8.38 57.4,7.75 57.78,7.37 R15.P$1 | IC7.4 62.1,16.51 64.26,14.35 v64.26,14.22 | 43.31,7.33 C12.2 43.35,6.52 43.18,6.35 41.91,6.35 v41.78,6.48 | v38.1,5.46 38.1,6.22 37.85,6.48 36.77,6.48 R4.P$2 | C19.P$2 56.58,14.8 56.26,15.11 54.1,15.11 53.72,15.49 v53.72,16.76 52.83,16.76 52.41,16.34 52.41,13.94 C20.P$2 | C25.P$2 57.72,33.85 v58.04,34.16
  pour Ground: 35.81,4.06 47.12,4.06 47.12,0.89 80.39,0.89 80.39,44.58 62.99,44.58 62.99,48.13 54.61,48.13 54.61,38.73 57.28,38.73 57.28,32 62.74,32 62.74,17.78 51.31,17.78 51.31,23.11 54.86,23.11 54.86,28.45 43.69,28.45 43.69,26.54 38.86,26.54 38.86,31.5 31.11,31.5 31.11,26.29 37.85,26.29 37.85,16.13 35.43,16.13 35.43,9.78 37.59,9.78 37.59,12.95 57.66,12.95 57.66,5.08 53.85,5.08 53.85,7.62 35.81,7.62
  pour Top: 31.11,31.5 38.86,31.5 38.86,26.54 43.69,26.54 43.69,28.45 54.86,28.45 54.86,23.11 51.31,23.11 51.31,17.78 62.74,17.78 62.74,32 57.28,32 57.28,38.73 54.61,38.73 54.61,48.13 62.99,48.13 62.99,44.58 80.39,44.58 80.39,0.89 47.12,0.89 47.12,4.06 35.81,4.06 35.81,7.62 53.85,7.62 53.85,5.08 57.66,5.08 57.66,12.95 37.59,12.95 37.59,9.78 35.43,9.78 35.43,16.13 37.85,16.13 37.85,26.29 31.11,26.29
  pour Bottom: 31.11,31.5 38.86,31.5 38.86,26.54 43.69,26.54 43.69,28.45 54.86,28.45 54.86,23.11 51.31,23.11 51.31,17.78 62.74,17.78 62.74,32 57.28,32 57.28,38.73 54.61,38.73 54.61,48.13 62.99,48.13 62.99,44.58 80.39,44.58 80.39,0.89 47.12,0.89 47.12,4.06 35.81,4.06 35.81,7.62 53.85,7.62 53.85,5.08 57.66,5.08 57.66,12.95 37.59,12.95 37.59,9.78 35.43,9.78 35.43,16.13 37.85,16.13 37.85,26.29 31.11,26.29
AREF  (via drill 0.6)
  Top 0.203: IC6.5 59.67,12.05 61.09,13.46 61.09,16.38 63.37,18.67 v64.52,18.67 | v43.56,49.02 63.5,49.02 64.64,47.88 66.67,47.88 67.82,46.74 71.12,46.74 75.95,41.91 75.95,39.24 74.59,37.88 C33.1 74.59,21.12 73.15,19.68 v72.14,19.68
  Bottom 0.203: v43.56,49.02 24.26,49.02 23.88,49.4 J8.AREF | v64.52,18.67 65.15,18.03 70.48,18.03 v72.14,19.68
CODEC_FSYNC_N
  Top 0.203: IC6.45 50.22,32.56 52.96,35.31 IC3.6
CODEC_MCLK
  Top 0.203: IC6.44 50.72,32.17 52.58,34.04 IC3.7
CODEC_RESET_N
  Top 0.203: IC6.38 53.72,28.58 54.1,28.19 55.12,28.19 55.75,28.83 55.75,30.73 57.78,32.77 IC3.9
CODEC_SCLK
  Top 0.203: IC6.43 51.22,31.66 52.32,32.77 IC3.8
CODEC_SDI
  Top 0.203: IC6.47 49.22,33.34 53.72,37.85 IC3.4
CODEC_SDO
  Top 0.203: IC6.46 49.72,32.95 53.34,36.58 IC3.5
FT232R_CTS_N
  Top 0.203: IC6.81 28.4,23.55 25.53,26.42 25.53,32.89 28.07,35.43 28.07,38.86 27.43,39.5 18.29,39.5 15,42.79 IC5.11
FT232R_RESET_N  (via drill 0.61)
  Top 0.203: IC5.19 15.65,39.09 v15.24,39.5 | v24.26,31.62 24.26,26.54 26.42,24.38 26.42,22.86 27.23,22.05 IC6.84
  Bottom 0.203: v15.24,39.5 23.24,39.5 24.26,38.48 v24.26,31.62
FT232R_RTS_N
  Top 0.203: IC5.3 20.2,41.52 21.21,40.51 28.45,40.51 29.21,39.75 29.21,34.29 26.67,31.75 26.67,27.56 28.18,26.05 IC6.76
FT232R_RXD
  Top 0.203: IC5.5 18.9,40.79 19.68,40.01 27.81,40.01 28.57,39.24 28.57,34.92 26.16,32.51 26.16,27.05 28.67,24.55 IC6.79
FT232R_RXLED_N
  Top 0.203: IC5.22 17.6,34.09 18.54,33.15 LED_RX.C
FT232R_TXD
  Top 0.203: IC5.1 21.5,41.88 22.35,41.02 28.96,41.02 29.72,40.26 29.72,33.91 27.18,31.37 27.18,27.94 28.57,26.55 IC6.75
FT232R_TXLED_N
  Top 0.203: IC5.23 18.25,34.97 18.8,34.42 LED_TX.C
GND  (via drill 0.6, 0.61, 0.76)
  Top 0.203: IC6.116 40.22,6.56 39.24,5.59 39.24,3.94 J10.GND.. | 2.41,29.67 C9.- 2.34,31.04 3.56,32.26 4.83,32.26 6.22,33.66 7.49,33.66 8,33.15 IC4.2 | IC5.26 20.2,36.45 v19.56,35.81 19.55,35.83 IC5.25 19.56,37.66 19.56,38.73 19.3,38.99 17.14,38.99 16.95,38.79 IC5.21 | C10.2 8.17,45.12 8.51,45.47 11.05,45.47 11.41,45.83 SW1.4 11.63,47.12 v16.38,47.12 17.14,47.12 17.6,46.66 IC5.7 | C10.2 8.26,44.45 | C10.2 6.73,44.45 4.32,46.86 2.34,46.86 SW1.3 | IC6.137 50.72,9.36 50.04,10.03 50.04,10.54 v49.66,10.92 | IC6.125 44.72,9.13 44.32,9.53 v43.69,9.53 | IC6.104 33.64,12.05 33.02,11.43 33.02,10.92 v32.64,10.54 | IC6.42 51.72,30.63 v52.58,31.5 | IC6.142 53.21,9.4 52.7,9.91 v52.7,11.05 | IC6.133 48.72,8.94 48.13,9.53 v47.88,9.53 | IC14.2 v21.97,12.45 | J2.5 6.38,39.34 6.99,38.73 6.99,36.45 5.84,35.31 3.17,35.31 2.54,34.67 v2.54,33.66 4.57,33.66 5.46,34.54 11.05,34.54 11.56,34.04 R8.P$1 | IC6.63 41.22,27.49 v41.27,27.43 | IC6.53 46.22,28.44 45.72,27.94 43.94,27.94 43.43,27.43 v41.27,27.43 | v41.27,27.43 39.88,26.04 38.61,26.04 37.85,26.8 37.85,27.56 38.72,28.43 IC6.68 | IC10.4 58.07,30.89 v57.02,29.84 | v28.83,27.81 R30.P$1 | LED_IOREF.C 27.69,5.46 27.3,5.08 24.51,5.08 JP6.2 21.84,5.33 21.59,5.08 C18.2 | IC6.95 33.69,16.55 33.15,16 v33.15,13.84 | IC6.83 36.64,22.55 v36.7,22.48 | IC3.14 59.18,39.12 58.67,39.62 v58.67,40.64
  Top 0.254: R3.P$1 19.36,20.39 v18.67,21.08 | C5.- 15.16,30.28 15.75,30.86 v20.19,30.86 | J2.4 J2.5
  Top 0.406: IC2.2 15.11,18.49 C1.- 14.99,18.41 14.99,16.89 14.48,16.38 v13.34,16.38
  Top 0.61: 4.17,20.19 IC1.1 4.06,20.3 4.06,21.34 2.34,23.06 C2.- C9.- | 4.17,20.19 4.19,20.19 | 4.17,20.19 2.79,20.19 2.03,19.43 2.03,11.43 J1.2 4.06,7.85 J1.1
  Bottom 0.203: IC13.11 23.36,29.98 22.48,30.86 v20.19,30.86 | R39.P$1 76.65,46.55 78.36,48.26 J7.2 | IC12.11 46.1,46.99 v45.34,47.75 | R4.P$1 37.53,4.51 37.97,4.06 39.5,4.06 40.64,2.92 J10.GND.. | IC11.GND1 3.52,48.99 4.06,49.53 v5.33,49.53 8,49.53 9.91,47.62 9.91,46.48 9.14,45.72 9.14,43.18 9.61,42.71 IC11.6 | v58.67,40.64 60.58,40.64 62.1,39.12 62.1,31.11 60.83,29.84 v57.02,29.84
  Bottom 0.406: IC11.GND2 15.22,32.02 15.37,31.88 15.37,31.75 16.26,30.86 v20.19,30.86
  pour Ground: 0.89,52.45 80.39,52.45 80.39,45.21 63.88,45.21 63.88,48.77 53.98,48.77 53.98,38.1 56.52,38.1 56.52,31.5 62.1,31.5 62.1,18.41 51.82,18.41 51.82,22.48 55.63,22.48 55.63,28.96 43.05,28.96 43.05,27.18 39.5,27.18 39.5,32 30.48,32 30.48,25.65 37.08,25.65 37.08,16.64 34.8,16.64 34.8,9.27 38.23,9.27 38.23,12.32 56.9,12.32 56.9,5.84 54.61,5.84 54.61,8.13 35.18,8.13 35.18,3.3 46.48,3.3 46.48,0.89 0.89,0.89
  pour Top: 30.48,32 39.5,32 39.5,27.18 43.05,27.18 43.05,28.96 55.63,28.96 55.63,22.48 51.82,22.48 51.82,18.41 62.1,18.41 62.1,31.5 56.52,31.5 56.52,38.1 53.98,38.1 53.98,48.77 63.88,48.77 63.88,45.21 80.39,45.21 80.39,52.45 0.89,52.45 0.89,0.89 46.48,0.89 46.48,3.3 35.18,3.3 35.18,8.13 54.61,8.13 54.61,5.84 56.9,5.84 56.9,12.32 38.23,12.32 38.23,9.27 34.8,9.27 34.8,16.64 37.08,16.64 37.08,25.65 30.48,25.65
  pour Bottom: 30.48,32 39.5,32 39.5,27.18 43.05,27.18 43.05,28.96 55.63,28.96 55.63,22.48 51.82,22.48 51.82,18.41 62.1,18.41 62.1,31.5 56.52,31.5 56.52,38.1 53.98,38.1 53.98,48.77 63.88,48.77 63.88,45.21 80.39,45.21 80.39,52.45 0.89,52.45 0.89,0.89 46.48,0.89 46.48,3.3 35.18,3.3 35.18,8.13 54.61,8.13 54.61,5.84 56.9,5.84 56.9,12.32 38.23,12.32 38.23,9.27 34.8,9.27 34.8,16.64 37.08,16.64 37.08,25.65 30.48,25.65
IOREF  (via drill 0.6)
  Top 0.203: 30.48,2.67 30.61,2.67 | v42.04,13.08 42.04,10.79 41.53,10.29 38.23,10.29 37.59,9.65 36.07,9.65 34.8,8.38 33.66,8.38 32.64,7.37 31.11,7.37 30.48,6.73 J10.I/OREF | v52.2,43.05 50.55,44.7 39.88,44.7 37.59,42.42 37.59,41.66 36.7,40.77 34.04,40.77 33.02,39.75 v33.02,36.07 | C18.1 20.79,2.45 20.32,2.92 20.32,3.94 19.3,4.95 JP1.2
  Top 0.305: 30.48,2.67 30.35,2.54 J10.I/OREF 28.7,4.32 28.7,8.89 27.81,9.78 23.75,9.78 23.05,9.08 R22.P$2 21.97,7.75 19.18,4.95 JP1.2
  Top 1.016: J10.I/OREF 30.48,2.67
  Bottom 0.203: v42.04,13.08 42.04,15.11 41.27,15.88 41.27,23.37 37.34,27.3 33.27,27.3 32.63,27.95 IC13.19 32.63,35.68 v33.02,36.07 | IC12.19 51.3,43.95 v52.2,43.05
JTAGEN
  Top 0.203: IC6.15 58.26,17.05 R33.P$2
MICRO_SD_CD_DAT3  (via drill 0.6)
  Top 0.203: IC6.69 38.22,33.03 36.96,34.29 v36.96,39.12
  Bottom 0.203: IC11.2 13.29,38.31 13.46,38.48 13.46,40.39 14.35,41.27 20.95,41.27 21.72,42.04 21.72,43.18 22.61,44.07 36.96,44.07 37.72,43.31 37.72,39.88 v36.96,39.12
MICRO_SD_CLK  (via drill 0.6)
  Top 0.203: IC6.65 40.22,35.86 39.88,36.2 v39.88,42.42
  Bottom 0.203: IC11.5 12.53,41.61 13.59,42.67 19.56,42.67 20.32,43.43 20.32,43.94 21.72,45.34 39.24,45.34 39.88,44.7 v39.88,42.42
MICRO_SD_CMD  (via drill 0.6)
  Top 0.203: IC6.66 39.72,32.93 38.73,33.91 v38.73,39.12
  Bottom 0.203: IC11.3 12.62,39.41 12.83,39.62 12.83,40.89 13.84,41.91 20.57,41.91 20.95,42.29 20.95,43.43 22.23,44.7 37.97,44.7 38.73,43.94 v38.73,39.12
MICRO_SD_DAT0  (via drill 0.6)
  Top 0.203: IC6.64 40.72,35.89 41.02,36.2 v41.02,40.77
  Bottom 0.203: IC11.7 19.05,43.81 21.34,46.1 39.88,46.1 41.02,44.96 v41.02,40.77
MICRO_SD_DAT1  (via drill 0.6)
  Top 0.203: IC6.62 41.72,34.98 42.42,35.69 v42.42,39.24
  Bottom 0.203: IC11.8 18.75,44.91 20.57,46.74 40.51,46.74 42.42,44.83 v42.42,39.24
MICRO_SD_DAT2  (via drill 0.6)
  Top 0.203: IC6.70 37.72,32.13 35.31,34.54 v35.31,39.12
  Bottom 0.203: IC11.1 13.59,37.21 14.1,37.72 14.1,40.01 14.73,40.64 21.72,40.64 22.35,41.27 22.35,42.8 22.99,43.43 36.32,43.43 36.83,42.93 36.83,40.64 v35.31,39.12
N$1
  Top 0.61: D1.2 12.22,11.3 J1.3
N$3
  Top 0.203: R8.P$2 10.73,31.18 9.82,32.09 IC4.1
  Top 0.406: R7.P$1 R8.P$2
N$4
  Top 0.406: IC2.3 16.02,22.61 16,22.61 16.07,22.67 L1.1
N$5
  Top 0.406: R1.P$2 14.12,22.61 IC2.1
N$6
  Top 0.254: IC2.5 14.18,24.85 14.22,24.89 14.22,24.13 14.61,23.75 C4.2 20.99,22.32 | R3.P$2 20.99,22.32 | 20.99,22.32 20.97,22.35 20.95,22.35 21.02,22.29 R2.P$1
N$7
  Top 0.203: J2.1 6.51,41.94 7.24,42.67 F1.1
N$8
  Top 0.203: IC3.10 62.87,34.04 63.92,32.98 C3.1
N$9  (via drill 0.6)
  Top 0.203: IC3.16 63.5,41.66 64.01,41.15 64.01,39.12 63.37,38.48 63.37,34.54 64.64,33.27 68.33,33.27 68.83,32.77 v70.1,32.77
  Bottom 0.203: v70.1,32.77 70.87,33.53 70.87,35.81 71.5,36.45 73.66,36.45 74.93,35.18 74.93,23.5 75.5,22.92 C6.P$1
N$10
  Top 0.203: C8.1 57.44,36.28 58.42,35.31 IC3.11
N$11  (1 unrouted)
  Top 0.203: 69.81,4.57 67.94,4.57 67.31,5.21 49.15,5.21 48.22,6.14 IC6.132
N$12
  Top 0.203: IC4.4 PMOS1.3
N$13
  Top 0.203: IC6.88 28.94,20.05 28.07,19.18 28.07,16.13 30.29,13.9 IC14.3
N$14  (via drill 0.6)
  Top 0.203: IC6.11 41.22,15.05 40.39,15.88 40.39,19.68 42.67,21.97 v42.67,23.11
  Bottom 0.203: v42.67,23.11 R27.P$1 C23.P$1
N$15  (via drill 0.61)
  Top 0.203: 14.35,37.59 14.35,37.6 IC5.17 14.35,36.45 14.1,36.2 8.26,36.2 v7.87,35.81 | IC5.4 19.55,46.62 17.91,48.26 9.65,48.26 8.13,46.74 v8.13,46.61
  Top 0.305: R10.P$2 R9.P$2 24.57,37.06 C11.1 23.11,37.08 v22.86,37.34
  Bottom 0.203: v8.13,46.61 6.6,45.09 3.81,45.09 2.29,43.56 2.29,36.96 3.43,35.81 v7.87,35.81 8.26,36.2 13.97,36.2 14.35,36.58 14.35,36.7 14.99,37.34 v22.86,37.34
N$16
  Top 0.305: R9.P$1 LED_TX.A
N$17
  Top 0.305: R10.P$1 LED_RX.A
N$18
  Top 0.61: R22.P$1 LED_IOREF.A
N$19
  Bottom 0.203: R12.P$2 53.05,5.11 C13.1 53.02,6.63 R13.P$1 54.1,8 56.64,10.54 57.91,10.54 58.8,11.43 71.37,11.43 73.03,13.08 73.03,15.75 72.26,16.51 IC7.5
N$20
  Bottom 0.203: R18.P$2 71.82,2.92 R19.P$1 71.88,2.92 71.92,2.96 C16.1 76.11,2.96 77.09,3.94 77.09,11.68 75.69,13.08 75.69,20.83 74.3,22.23 74.3,26.54 73.53,27.3 70.1,27.3 69.22,26.42 69.22,25.4 68.71,24.89 67.48,24.89 IC8.10
N$22
  Bottom 0.203: R14.P$2 R15.P$2 60.64,8.32 61.43,9.11 C14.1 62.87,10.41 63.37,10.92 72.26,10.92 73.79,12.45 73.79,16.26 72.64,17.4 64.01,17.4 63.5,17.91 63.5,22.99 62.88,23.61 IC8.3
N$23
  Bottom 0.203: R16.P$2 61.59,4.57 61.98,4.95 C15.1 62.08,5.91 R17.P$2 64.2,5.91 65.28,4.83 66.93,4.83 67.94,5.84 68.58,5.84 69.09,6.35 69.09,9.78 69.72,10.41 73.15,10.41 74.42,11.68 74.42,18.92 71.75,21.59 65.15,21.59 64.52,22.23 64.52,24.13 63.74,24.91 IC8.5
N$24  (via drill 0.6)
  Top 0.203: IC6.6 56.36,12.55 56.39,12.57 49.28,12.57 v48.26,11.56
  Bottom 0.203: v48.26,11.56 48.9,12.19 R23.P$2 54.65,12.22 54.68,12.22 C19.P$1
N$25  (via drill 0.6)
  Top 0.203: IC6.7 47.72,13.05 v47.37,12.7
  Bottom 0.203: v47.37,12.7 48.51,13.84 C20.P$1 50.67,13.9 R24.P$2
N$26  (via drill 0.6)
  Top 0.203: IC6.8 48.05,13.55 47.75,13.84 45.97,13.84 45.72,13.59 v45.72,12.7
  Bottom 0.203: v45.72,12.7 45.72,14.99 45.97,15.24 C21.P$1 47.06,16.9 R25.P$2
N$27  (via drill 0.6)
  Top 0.203: v65.91,1.91 65.02,1.02 48.77,1.02 48.26,1.52 v48.26,2.67
  Bottom 0.203: v65.91,1.91 76.58,1.91 78.11,3.43 78.11,10.03 79.76,11.68 79.76,32.77 78.15,34.37 PT1.1A | IC7.3 62.1,15.24 62.61,14.73 62.61,12.7 61.85,11.94 58.42,11.94 57.66,11.18 56.01,11.18 53.85,9.02 48.9,9.02 48.01,8.13 R11.P$2 47.94,7.37 C12.1 45.05,6.52 45.34,6.22 46.35,6.22 46.99,5.59 46.99,3.94 v48.26,2.67
N$28
  Bottom 0.203: R20.P$2 70.17,6.2 C17.1 70.14,7.85 R21.P$2 70.17,8.83 70.87,9.53 72.39,9.53 73.03,8.89 75.56,8.89 76.2,9.53 76.2,11.18 75.06,12.32 75.06,19.68 72.52,22.23 70.87,22.23 69.48,23.61 IC8.12
N$29  (via drill 0.6)
  Top 0.203: IC6.10 44.26,14.55 43.81,14.1 v43.81,13.21
  Bottom 0.203: v43.81,13.21 43.81,14.35 45.53,16.06 R26.P$2 C22.P$1
N$30  (via drill 0.6)
  Top 0.203: IC6.12 52.27,15.55 50.67,17.14 50.67,23.62 49.91,24.38 v48.51,24.38
  Bottom 0.203: R28.P$1 48.58,24.45 v48.51,24.38 48.51,25.65 49.46,26.6 C24.P$1
N$32
  Top 0.203: J3.1 76.8,12.74 73.15,16.38 67.56,16.38 67.06,16.89 67.06,31.62 66.67,32 C3.2
N$34  (via drill 0.6)
  Top 0.203: IC6.9 57.96,14.05 v58.17,13.84
  Bottom 0.203: v58.17,13.84 F4.2
N$35
  Top 0.203: C8.2 59.14,44.24 MIC1.4
N$36
  Top 0.203: IC3.2 54.61,40.39 53.34,41.66 53.34,46.23 55.37,48.26 61.47,48.26 62.68,47.05 R5.P$1
N$37  (via drill 0.6)
  Top 0.203: IC3.1 54.74,41.66 54.36,42.04 54.36,45.97 55.88,47.5 61.09,47.5 62.48,46.1 62.48,44.58 63.25,43.81 64.77,43.81 65.91,42.67 65.91,39.12 67.44,37.59 69.6,37.59 v71.88,35.31
  Bottom 0.203: v71.88,35.31 C7.P$1
N$39
  Bottom 0.203: R29.P$2 69.95,30.01 71.86,30.01 C7.P$2
N$40
  Top 0.203: IC6.143 53.72,9.01 53.72,9.02 53.72,9.78 54.49,10.55 IC6.2 57.27,10.55 58,9.82 F5.2
N$41
  Bottom 0.203: R6.P$2 C6.P$2
N$42  (via drill 0.6)
  Top 0.203: J4.1 76.83,21.97 76.83,16.38 v76.71,16.26
  Bottom 0.203: R6.P$1 76.96,16.51 v76.71,16.26
N$43  (via drill 0.6)
  Top 0.203: J4.4 69.4,31.31 68.96,31.75 v68.07,31.75
  Bottom 0.203: R29.P$1 68.01,31.69 v68.07,31.75
N$49
  Top 0.203: R5.P$2 67.75,45.15 69.98,42.93 69.98,39.24 73.15,36.07 73.15,25.53 69.4,21.77 J3.4
N$67
  Top 0.203: 46.35,4.95 R36.P$2 46.16,5.78 46.72,6.33 IC6.129
N$68  (via drill 0.6)
  Top 0.203: v43.56,11.56 46.48,11.56 47.5,10.54 48.51,10.54 50.22,8.84 IC6.136
  Bottom 0.203: v43.56,11.56 42.67,11.56 40.51,9.4 40.51,5.71 40.89,5.33 R37.P$1
N$69
  Top 0.203: IC6.138 51.22,6.7 52.2,5.71 56.39,5.71 56.77,6.1 R38.P$1
N$70  (via drill 0.6)
  Top 0.203: IC6.126 45.21,9.65 44.32,10.54 42.93,10.54 42.16,9.78 38.48,9.78 37.85,9.14 36.45,9.14 34.54,7.24 R40.P$2 34.48,6.35 33.53,6.35 32.51,5.33 v31.62,5.33
  Bottom 0.203: v31.62,5.33 27.69,5.33 25.15,2.79 JP6.1
N$71
  Top 0.203: IC6.121 42.72,7.07 43.18,6.6 43.18,5.21 42.93,4.95 R41.P$2
N$72
  Top 0.203: LED1.C 68.45,1.27 65.66,4.06 48.13,4.06 47.22,4.98 IC6.130
N$73
  Top 0.203: IC6.131 47.72,5.62 48.77,4.57 66.29,4.57 68.33,2.54 LED2.C
N$77
  Top 0.254: R42.P$1 LED1.A
N$78
  Top 0.254: LED2.A R43.P$1
N$83  (1 unrouted)
  Top 0.203: R47.P$1 78.17,4.57 74.97,4.57
N$85
  Top 0.203: IC6.4 60.06,11.55 61.59,13.08 66.04,13.08 66.8,12.32 70.99,12.32 72.05,11.26 F7.2
PIN0_RX
  Bottom 0.203: IC12.20 52.07,45.34 59.56,45.34 63.5,49.28 J9.0
PIN1_TX
  Bottom 0.203: IC12.18 50.65,46.46 51.18,46.99 59.31,46.99 60.96,48.64 J9.1
PIN2
  Bottom 0.203: IC12.17 50,46.7 51.05,47.75 57.53,47.75 58.42,48.64 J9.2
PIN3~
  Bottom 0.203: IC12.16 49.35,47.06 50.8,48.51 54.86,48.51 55.88,49.53 J9.3
PIN4
  Bottom 0.203: IC12.15 48.7,45.28 48.64,45.34 48.64,47.37 50.29,49.02 52.7,49.02 53.34,49.66 J9.4
PIN5~
  Bottom 0.203: IC12.14 48.05,48.05 J9.5
PIN6~
  Bottom 0.203: IC12.13 47.4,49.94 J9.6
PIN7
  Bottom 0.203: IC12.12 46.75,49.77 J9.7
PIN8  (via drill 0.61)
  Top 0.203: v35.69,42.16 35.69,43.05 41.66,49.02 J8.8
  Bottom 0.203: v35.69,42.16 35.69,41.27 34.16,39.75 34.16,34.8 33.28,33.91 IC13.20
PIN9~  (via drill 0.61)
  Top 0.203: J8.9 39.12,47.62 36.96,45.47 35.81,45.47 33.91,43.56 v33.91,42.16
  Bottom 0.203: v33.91,42.16 33.91,40.89 31.98,38.96 IC13.18
PIN10~  (via drill 0.61)
  Top 0.203: v32.26,42.16 32.26,43.69 36.58,48.01 J8.10
  Bottom 0.203: IC13.17 31.33,40.34 32.26,41.27 v32.26,42.16
PIN11~  (via drill 0.61)
  Top 0.203: J8.11 34.04,47.24 30.73,43.94 v30.73,42.16
  Bottom 0.203: IC13.16 30.68,42.11 v30.73,42.16
PIN12  (via drill 0.61)
  Top 0.203: v28.83,42.16 28.83,43.94 31.5,46.61 J8.12
  Bottom 0.203: IC13.15 30.03,35.25 28.83,36.45 v28.83,42.16
PIN13  (via drill 0.61)
  Top 0.203: v27.05,42.16 27.05,43.94 28.96,45.85 J8.13
  Bottom 0.203: IC13.14 29.38,34.25 27.05,36.58 v27.05,42.16
RESET_N  (via drill 0.6)
  Top 0.203: SW1.1 4.23,51.4 4.7,50.93 v6.73,50.93 8.51,50.93 8.98,51.4 SW1.2 | IC6.60 42.72,34.84 v43.56,35.69 | v18.92,11.56 17.14,9.78 15.75,9.78 v15.11,9.14
  Bottom 0.203: v43.56,35.69 44.13,36.26 R32.P$2 44.13,39.94 43.05,41.02 43.05,45.72 40.77,48.01 20.57,48.01 18.29,45.72 12.45,45.72 11.18,46.99 11.18,47.88 8.13,50.93 v6.73,50.93 3.17,50.93 1.4,49.15 1.4,14.73 2.92,13.21 11.94,13.21 15.11,10.03 v15.11,9.14 | J10.RESET 33.02,6.22 31.88,7.37 23.37,7.37
  Bottom 0.254: 23.37,7.37 21.95,7.37 arc-45 21.77,7.44 19,10.21 arc-45 18.92,10.39 v18.92,11.56
SCL  (via drill 0.61)
  Top 0.203: v23.37,42.16 23.37,45.59 22.1,46.86 21.21,46.86 18.8,49.28 J8.SCL
  Bottom 0.203: IC13.12 28.08,31.61 27.3,32.38 26.16,32.38 25.53,33.02 25.53,38.99 23.37,41.15 v23.37,42.16
SDA  (via drill 0.61)
  Top 0.203: v25.15,42.16 25.15,45.34 22.86,47.62 22.23,47.62 21.34,48.51 J8.SDA
  Bottom 0.203: IC13.13 28.73,30.2 28.7,30.23 28.7,32.77 28.19,33.27 26.8,33.27 26.42,33.66 26.42,40.13 25.15,41.4 v25.15,42.16
SRAM_CS_N
  Top 0.203: IC6.29 57.7,24.05 58.42,24.77 58.42,26.8 58.93,27.3 60.33,27.3 61.01,27.98 IC10.1
SRAM_SCK
  Top 0.203: IC6.27 58.99,23.05 59.7,23.76 IC10.6
SRAM_SIO0
  Top 0.203: IC6.28 58.73,23.55 59.05,23.88 IC10.5
SRAM_SIO1
  Top 0.203: IC6.32 57.55,25.55 57.91,25.91 57.91,27.56 58.42,28.07 59.44,28.07 60.35,28.99 IC10.2
SRAM_SIO2
  Top 0.203: IC6.33 57.16,26.05 57.4,26.29 57.4,28.32 57.78,28.7 58.93,28.7 59.7,29.48 IC10.3
SRAM_SIO3
  Top 0.203: IC6.26 59.5,22.55 60.35,23.4 IC10.7
TCK  (via drill 0.6)
  Top 0.203: v69.09,35.18 69.47,35.18 72.26,32.38 72.26,28.07 71.5,27.3 70.1,27.3 68.07,25.27 v68.07,20.57 | v65.91,20.57 65.79,20.45 61.34,20.45 59.44,18.55 IC6.18
  Bottom 0.203: J7.1 79.38,50.8 80.26,49.91 80.26,46.48 79.5,45.72 R39.P$2 78.49,45.72 78.49,44.83 78.36,44.7 76.2,44.7 75.31,43.81 71.37,43.81 69.98,42.42 69.98,38.23 69.09,37.34 v69.09,35.18 | v65.91,20.57 v68.07,20.57
TDI  (via drill 0.6)
  Top 0.203: IC6.19 58.93,19.05 60.83,20.95 64.9,20.95 66.04,22.1 v66.04,29.72
  Bottom 0.203: J7.9 69.85,49.53 69.85,47.12 70.55,46.42 R34.P$1 67.69,44.96 65.66,42.93 65.66,41.53 63.37,39.24 63.37,34.54 66.04,31.88 v66.04,29.72
TDO  (via drill 0.6)
  Top 0.203: IC6.20 58.28,19.55 60.2,21.46 64.52,21.46 65.53,22.48 65.53,27.81 64.39,28.96 v64.39,30.1
  Bottom 0.203: J7.3 74.8,52.2 67.69,52.2 67.06,51.56 67.06,46.23 64.77,43.94 64.77,42.04 62.74,40.01 62.74,33.4 64.39,31.75 v64.39,30.1
TMS  (via drill 0.6)
  Top 0.203: IC6.16 54.97,17.55 54.23,18.29 52.32,18.29 51.18,19.43 51.18,24.64 v50.16,25.65 | v65.41,48.9 65.41,50.93 66.67,52.2 72.26,52.2 J7.5
  Bottom 0.203: v65.41,48.9 66.29,48.01 66.29,46.74 63.75,44.2 63.75,42.67 62.99,41.91 57.15,41.91 56.26,41.02 56.26,35.94 55.24,34.92 52.58,34.92 50.8,33.15 50.8,27.43 50.16,26.8 v50.16,25.65 | R35.P$1 72.39,46.42 72.39,49.53 J7.5
USB_DATA_N
  Top 0.203: IC5.16 13.72,37.67 13.72,40.13 12.56,41.29 J2.2
USB_DATA_P
  Top 0.203: J2.3 8.07,40.64 arc-90 8.41,40.3 8.41,40.07 arc90 8.75,39.73 10.24,39.73 arc90 10.58,40.07 10.58,40.3 arc-90 10.92,40.64 12.03,40.64 13.05,39.62 IC5.15
USBVCC  (via drill 0.6)
  Top 0.203: PMOS1.2 PMOS1.1 9.26,28.71 9.65,28.32 9.65,27.3 9.27,26.92 8.66,26.92 PMOS1.5 | PMOS1.6 8,25.65 v8.26,25.4 8.65,25.8 PMOS1.5 | v16.26,35.56 16.3,35.6 IC5.20 16.3,39.96 15.37,40.89 14.48,40.89 12.7,42.67 F1.2 | PMOS1.5 8.65,27.54 8.38,27.81 5.97,27.81 5.54,28.25 C9.+
  Top 0.305: C10.1 F1.2
  Bottom 0.406: v8.26,25.4 8.26,33.78 10.03,35.56 v16.26,35.56
VIN  (via drill 0.6, 0.76)
  Top 0.254: J10.VIN 44.27,1.09 arc-45 44.09,1.02 16.89,1.02 16.33,1.58 arc-45 16.26,1.76 16.26,8.38 16.82,8.94 arc-45 17,9.02 20.07,9.02 21.14,10.09 arc45 21.21,10.27 v21.21,10.29
  Top 0.406: v18.29,15.88 20.57,15.88 25.15,20.45 25.15,24.13 22.86,26.42 22.86,30.86 21.72,32 18.29,32 17.21,33.08 R7.P$2
  Top 0.61: IC1.3 4.14,14.53 4.57,14.1 D1.1 17.91,14.1 18.29,14.48 v18.29,15.88 18.29,18.36 C1.+
  Bottom 0.254: v21.21,10.29 20.32,11.18 20.32,13.74 arc45 20.25,13.92 v18.29,15.88

## Text on the board
tPlace: Mustang Duino | PulseRain Technology | Ear Plug | Microphone | 5V | 3.3V